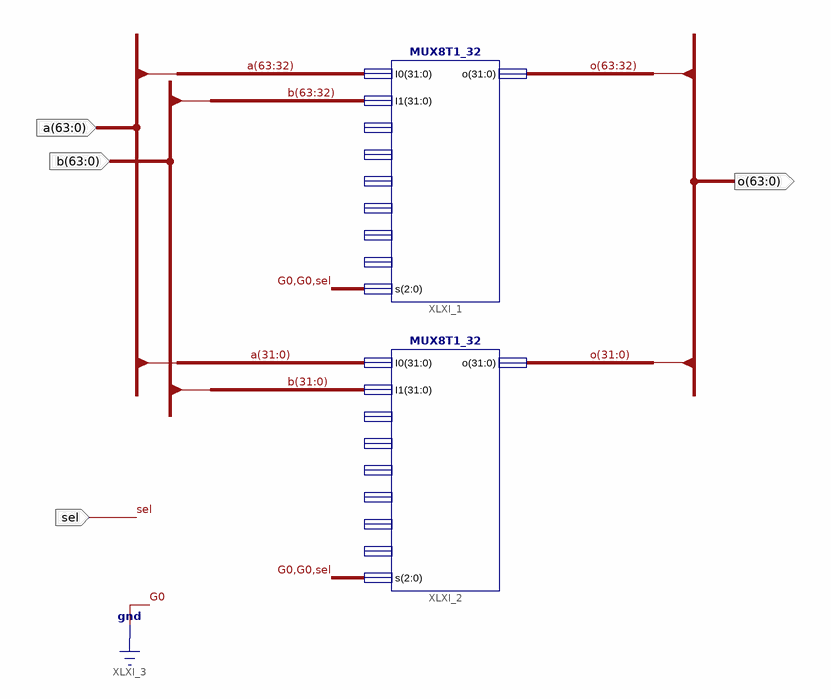
[diagram p0: schematic sheet 1]
// Xilinx ISE schematic MUX2T1_64.sch (kintex7) as structural Verilog: 2 symbols, 4 ports
module MUX2T1_64 (
  input  [63:0] a,
  input  [63:0] b,
  input  sel,
  output [63:0] o
);

  MUX8T1_32 XLXI_1 (.I0(a[63:32]), .I1(b[63:32]), .s({2'b00, sel}), .o(o[63:32]));  // open: I2, I3, I4, I5, I6, I7
  MUX8T1_32 XLXI_2 (.I0(a[31:0]), .I1(b[31:0]), .s({2'b00, sel}), .o(o[31:0]));  // open: I2, I3, I4, I5, I6, I7
endmodule
